# EAGLE design Project_02 (EAGLE 9.6.2)
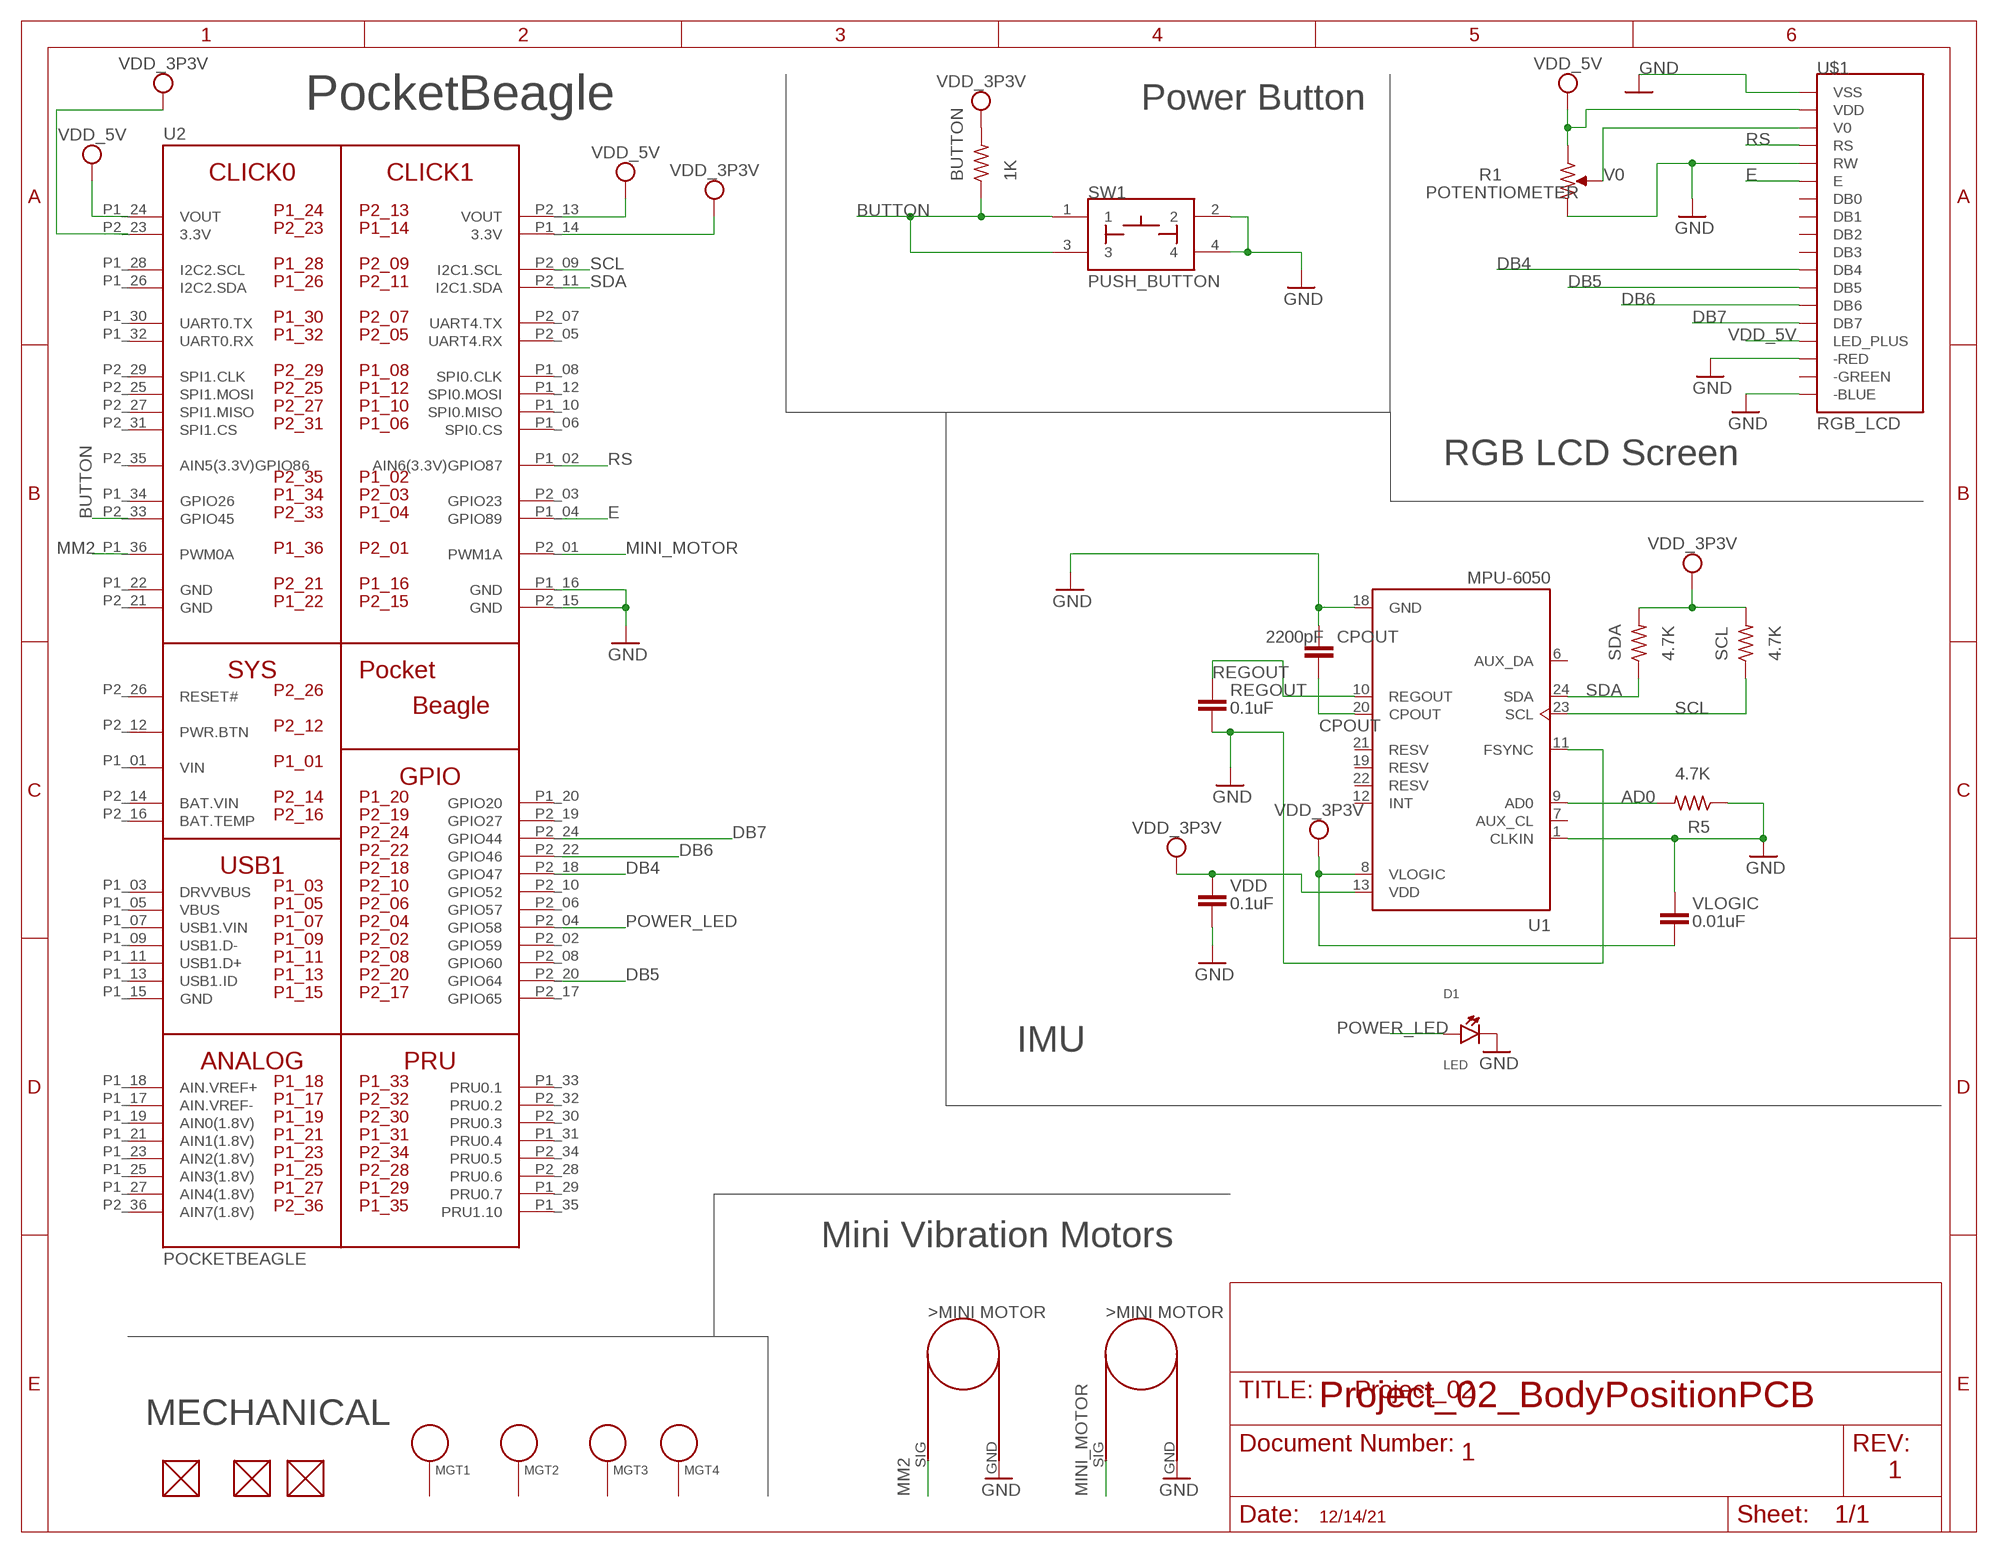
[diagram p0: schematic, sheet 1]

## Parts
BUTTON  1K  R_R0402  [R0402]
CPOUT  2200pF  C_C0603  [C0603]
D1  LED  [EIA-STD]
FUD1  FIDUCIAL  [FIDUCIAL_40MIL]
FUD2  FIDUCIAL  [FIDUCIAL_40MIL]
FUD3  FIDUCIAL  [FIDUCIAL_40MIL]
M1  MINI_MOTOR  [MINI_MOTOR]
M2  MINI_MOTOR  [MINI_MOTOR]
MGT1  MOUNTING_HOLE  [MOUNTING_HOLE]
MGT2  MOUNTING_HOLE  [MOUNTING_HOLE]
MGT3  MOUNTING_HOLE  [MOUNTING_HOLE]
MGT4  MOUNTING_HOLE  [MOUNTING_HOLE]
R1  POTENTIOMETER  [POT-PO90S]
R5  4.7K  R_R0402  [R0402]
REGOUT  0.1uF  C_C0603  [C0603]
SCL  4.7K  R_R0402  [R0402]
SDA  4.7K  R_R0402  [R0402]
SW1  PUSH_BUTTON  [BUTTON_12.5MM]
U1  MPU-6050  [MPU-6050]
U2  POCKETBEAGLE  [POCKETBEAGLE]
U$1  RGB_LCD  [RGB_LCD]
VDD  0.1uF  C_C0603  [C0603]
VLOGIC  0.01uF  C_C0603  [C0603]

## Nets
AD0: R5.2 U1.9(AD0)
BUTTON: BUTTON.1 SW1.1 SW1.3 U2.P2_33(GPIO45)
CPOUT: CPOUT.2 U1.20(CPOUT)
DB4: U2.P2_18(GPIO47) U$1.DB4
DB5: U2.P2_20(GPIO64) U$1.DB5
DB6: U2.P2_22(GPIO46) U$1.DB6
DB7: U2.P2_24(GPIO44) U$1.DB7
E: U2.P1_04(GPIO89) U$1.E
GND: CPOUT.1 D1.CATHODE M1.GND M2.GND R1.CW R5.1 REGOUT.2 SW1.2 SW1.4 U1.1(CLKIN) U1.11(FSYNC) U1.18(GND) U2.P1_16(GND) U2.P2_15(GND) U$1.-BLUE U$1.-RED U$1.RW U$1.VSS VDD.2 VLOGIC.1
MINI_MOTOR: M1.SIG(PWM) U2.P2_01(PWM1A)
MM2: M2.SIG(PWM) U2.P1_36(PWM0A)
POWER_LED: D1.ANODE U2.P2_04(GPIO58)
REGOUT: REGOUT.1 U1.10(REGOUT)
RS: U2.P1_02(AIN6(3.3V)GPIO87) U$1.RS
SCL: SCL.1 U1.23(SCL) U2.P2_09(I2C1.SCL)
SDA: SDA.1 U1.24(SDA) U2.P2_11(I2C1.SDA)
V0: R1.S U$1.V0
VDD_3P3V: BUTTON.2 SCL.2 SDA.2 U1.8(VLOGIC) U1.13(VDD) U2.P1_14(3.3V) U2.P2_23(3.3V) VDD.1 VLOGIC.2
VDD_5V: R1.CCW U2.P1_24(VOUT) U2.P2_13(VOUT) U$1.LED_PLUS U$1.VDD
Unconnected: FUD1.P$1 FUD2.P$1 FUD3.P$1 MGT1.P$1 MGT2.P$1 MGT3.P$1 MGT4.P$1 U1.6(AUX_DA) U1.7(AUX_CL) U1.12(INT) U1.19(RESV) U1.21(RESV) U1.22(RESV) U2.P1_03(DRVVBUS) U2.P1_05(VBUS) U2.P1_06(SPI0.CS) U2.P1_07(USB1.VIN) U2.P1_08(SPI0.CLK) U2.P1_09(USB1.D-) U2.P1_10(SPI0.MISO) U2.P1_11(USB1.D+) U2.P1_12(SPI0.MOSI) U2.P1_13(USB1.ID) U2.P1_15(GND) U2.P1_17(AIN.VREF-) U2.P1_18(AIN.VREF+) U2.P1_19(AIN0(1.8V)) U2.P1_20(GPIO20) U2.P1_21(AIN1(1.8V)) U2.P1_23(AIN2(1.8V)) U2.P1_25(AIN3(1.8V)) U2.P1_26(I2C2.SDA) U2.P1_27(AIN4(1.8V)) U2.P1_28(I2C2.SCL) U2.P1_29(PRU0.7) U2.P1_30(UART0.TX) U2.P1_31(PRU0.4) U2.P1_32(UART0.RX) U2.P1_33(PRU0.1) U2.P1_34(GPIO26) U2.P1_35(PRU1.10) U2.P2_02(GPIO59) U2.P2_03(GPIO23) U2.P2_05(UART4.RX) U2.P2_06(GPIO57) U2.P2_07(UART4.TX) U2.P2_08(GPIO60) U2.P2_10(GPIO52) U2.P2_12(PWR.BTN) U2.P2_16(BAT.TEMP) U2.P2_17(GPIO65) U2.P2_19(GPIO27) U2.P2_25(SPI1.MOSI) U2.P2_26(RESET#) U2.P2_27(SPI1.MISO) U2.P2_28(PRU0.6) U2.P2_29(SPI1.CLK) U2.P2_30(PRU0.3) U2.P2_31(SPI1.CS) U2.P2_32(PRU0.2) U2.P2_34(PRU0.5) U2.P2_35(AIN5(3.3V)GPIO86) U2.P2_36(AIN7(1.8V)) U$1.-GREEN U$1.DB0 U$1.DB1 U$1.DB2 U$1.DB3

## Notes on the sheet
- PocketBeagle | Power Button
- RGB LCD Screen
- IMU
- Mini Vibration Motors
- Project_02_BodyPositionPCB
- MECHANICAL
- 1
- 1
- 12/14/21

## Power pins joined to a net without a drawn wire
BAT.VIN: U2.P2_14(BAT.VIN)
GND: U2.P1_22(GND) U2.P2_21(GND)
VIN: U2.P1_01(VIN)

## Library data of the parts
BUTTON R5 SCL SDA = Project_02:R_: RESISTOR, American symbol
CPOUT REGOUT VDD VLOGIC = Project_02:C_: Capacitor SMD. Sizes: 0402, 0603 & 0805
D1 = Project_02:LED: EIA-STD LED, LTST-C191TBKT
FUD1-FUD3 = Project_02:FIDUCIAL
M1 M2 = Project_02:MINI_MOTOR
MGT1-MGT4 = Project_02:MOUNTING_HOLE: Chassis Mounting Hole w/GND connection ability
R1 = Project_02:POTENTIOMETER: Potentiometer - Examples: P090S-14T20BR10K (987-1277-ND)
SW1 = Project_02:PUSH_BUTTON
U1 = Project_02:MPU-6050: MPU-6050 Six-Axis (Gyro + Accelerometer) MEMS MotionTracking™ Devices Check prices <https://pricing.snapeda.com/parts/MPU-6050/TDK%20InvenSense/view-part?ref=eda>; AVAILABILITY: In Stock; DESCRIPTION: MPU-6050 series Accelerometer, Gyroscope, 3 Axis Sensor Evaluation Board; MF: TDK InvenSense; MP: MPU-6050; PACKAGE: QFN-24 InvenSense; PRICE: None; PURCHASE-URL: https://pricing.snapeda.com/search/part/MPU-6050/?ref=eda
U2 = Project_02:POCKETBEAGLE
U$1 = Project_02:RGB_LCD

## Board
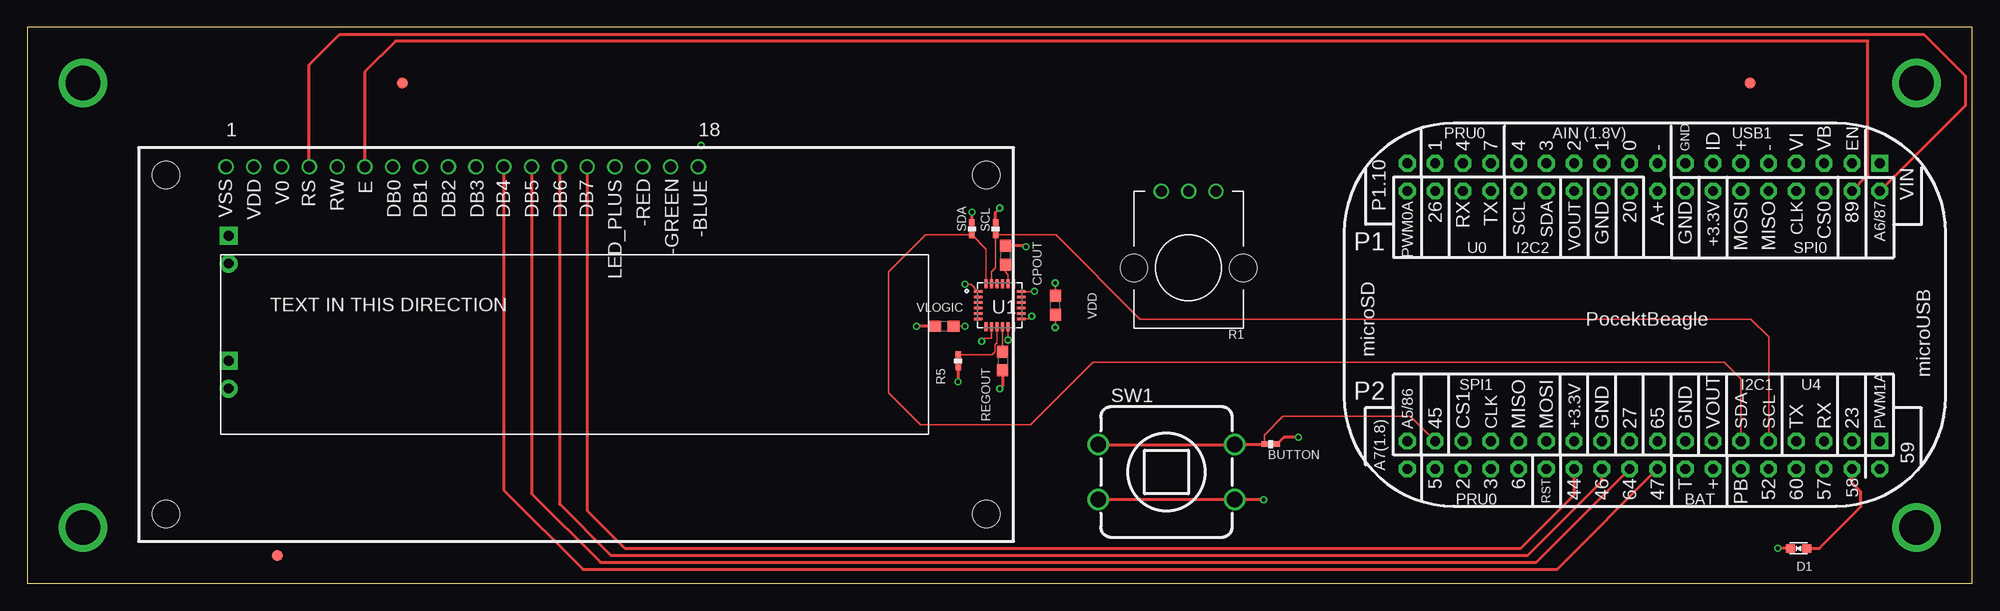
[diagram p1: board, top side]
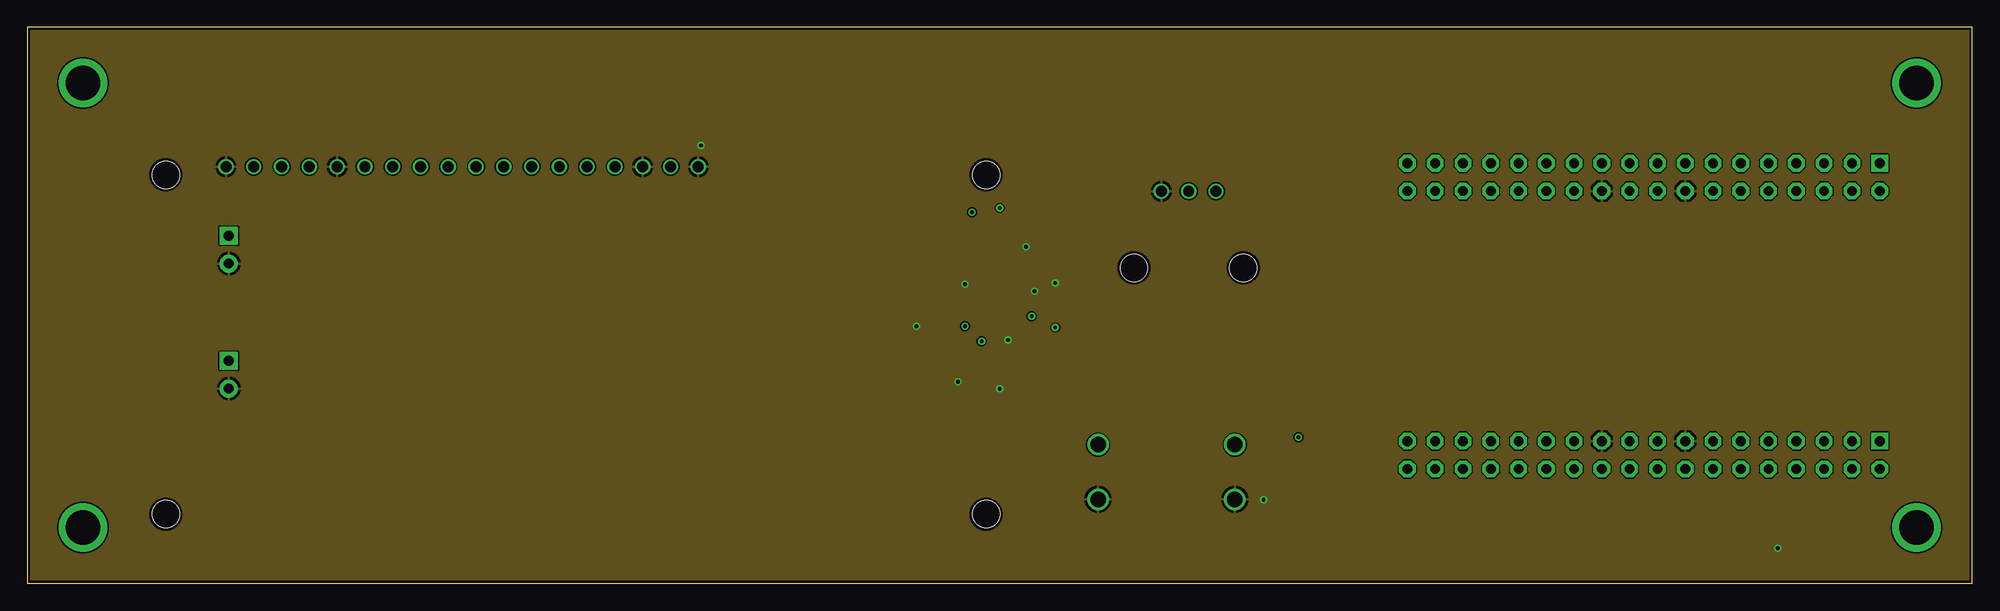
[diagram p2: board, inner layer Route2]
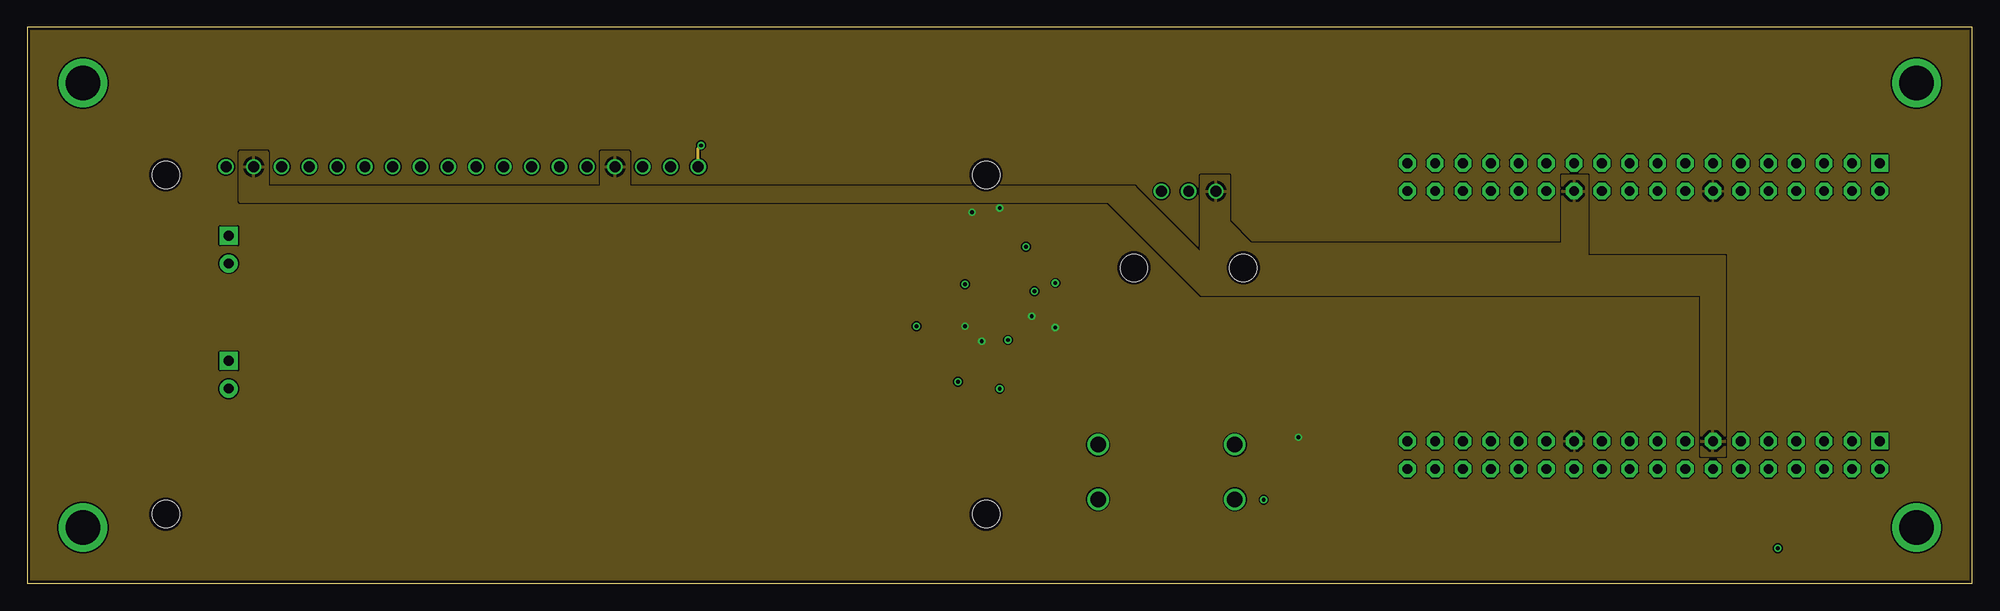
[diagram p3: board, inner layer Route15]
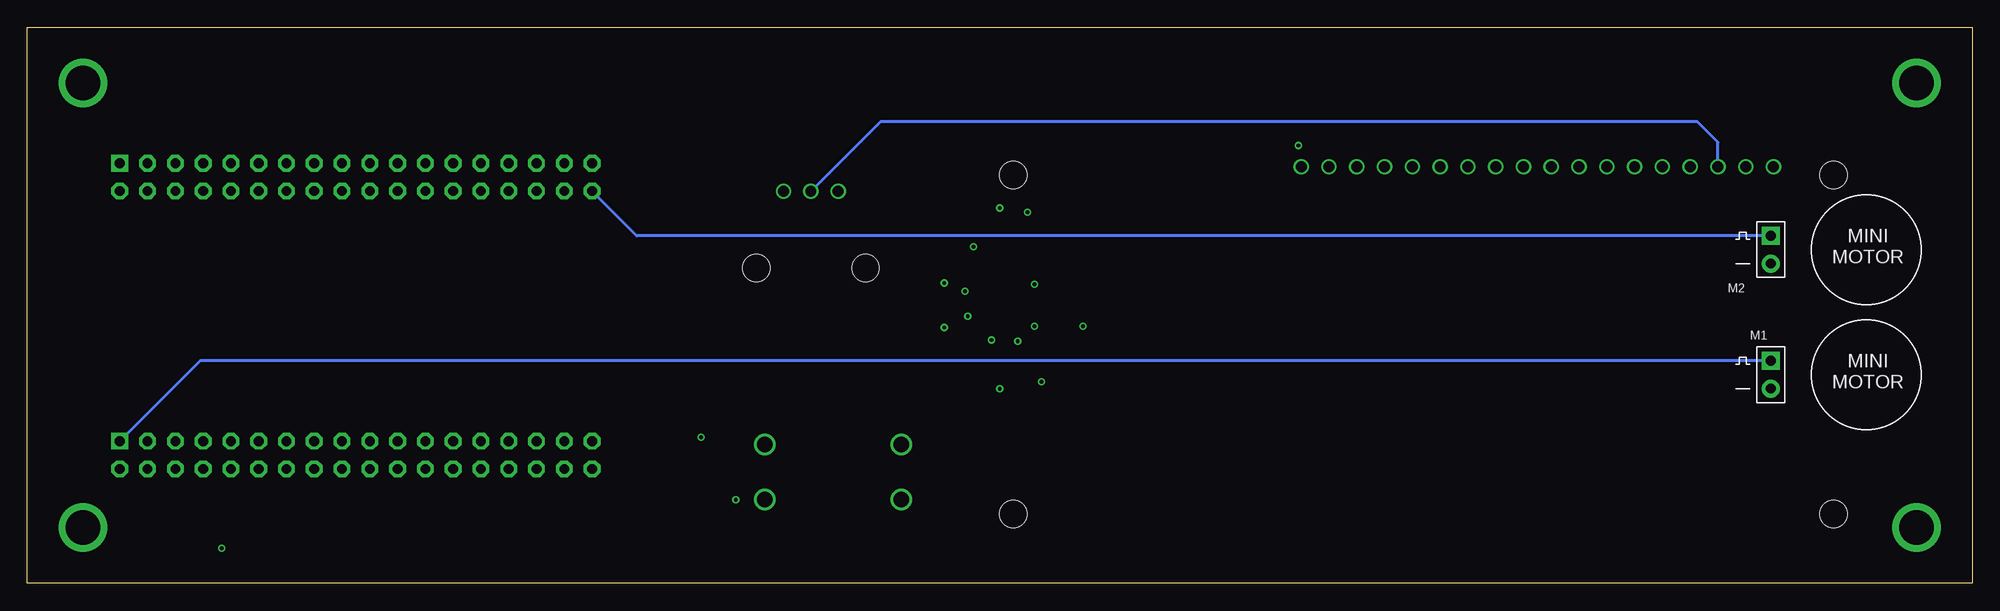
[diagram p4: board, bottom side, seen from below]

Size 177.8 x 50.8 mm. Coordinates in mm from the lower left corner, seen from the top.
Outline: 0,0 177.8,0 177.8,50.8 0,50.8 0,0
Copper layers (1*2*15*16): Top 0.035mm / dielectric 0.23mm / Route2 0.035mm / dielectric 0.93mm / Route15 0.035mm / dielectric 0.23mm / Bottom 0.035mm
Design rules "ENGI301_4lyr *": minimum track width 5mil, minimum drill 12mil, track to track 5mil, track to pad 5mil, pad to pad 5mil, via to via 5mil, smd to smd 5mil, copper to edge 10mil, drill to drill 12mil, minimum pad ring 6mil, minimum via ring 6mil, stop-mask expansion 3mil, vias tented up to drill 25mil, thermal gap 10mil

### Footprints (pad centres in the part's own frame; a part is rotated, then mirrored left to right if it is on the bottom)
R0402 = smd 0.61 x 0.508: 1 -0.559,0; 2 0.559,0
C0603 = smd 1.1 x 1: 1 -0.85,0; 2 0.85,0
EIA-STD = smd 0.8 x 0.8: ANODE -0.75,0; CATHODE 0.75,0
FIDUCIAL_40MIL = smd 1.016 x 1.016: P$1 0,0
MINI_MOTOR = drill 0.889 pad 1.651: GND 0,0 | drill 0.889 pad 1.651 square: SIG 0,2.54
MOUNTING_HOLE = drill 3.175 pad 4.445: P$1 0,0
POT-PO90S = drill 1: CCW -2.5,0; CW 2.5,0; S 0,0 | hole 2.5: -5,7; 5,7
BUTTON_12.5MM = drill 1.4: 1 -6.25,2.5; 2 -6.25,-2.5; 3 6.25,2.5; 4 6.25,-2.5
MPU-6050 = smd 0.79 x 0.26: 1 -1.97,1.25; 2 -1.97,0.75; 3 -1.97,0.25; 4 -1.97,-0.25; 5 -1.97,-0.75; 6 -1.97,-1.25; 13 1.97,-1.25; 14 1.97,-0.75; 15 1.97,-0.25; 16 1.97,0.25; 17 1.97,0.75; 18 1.97,1.25 | smd 0.26 x 0.79: 7 -1.25,-1.97; 8 -0.75,-1.97; 9 -0.25,-1.97; 10 0.25,-1.97; 11 0.75,-1.97; 12 1.25,-1.97; 19 1.25,1.97; 20 0.75,1.97; 21 0.25,1.97; 22 -0.25,1.97; 23 -0.75,1.97; 24 -1.25,1.97
POCKETBEAGLE = drill 0.889 pad 1.524 square: P1_01 5.91,3.53; P2_01 5.91,28.93 | drill 0.889 pad 1.524 octagon: P1_02 5.91,6.07; P1_03 8.45,3.53; P1_04 8.45,6.07; P1_05 10.99,3.53; P1_06 10.99,6.07; P1_07 13.53,3.53; P1_08 13.53,6.07; P1_09 16.07,3.53; P1_10 16.07,6.07; P1_11 18.61,3.53; P1_12 18.61,6.07; P1_13 21.15,3.53; P1_14 21.15,6.07; P1_15 23.69,3.53; P1_16 23.69,6.07; P1_17 26.23,3.53; P1_18 26.23,6.07; P1_19 28.77,3.53; P1_20 28.77,6.07; P1_21 31.31,3.53; P1_22 31.31,6.07; P1_23 33.85,3.53; P1_24 33.85,6.07; P1_25 36.39,3.53; P1_26 36.39,6.07; P1_27 38.93,3.53; P1_28 38.93,6.07; P1_29 41.47,3.53; P1_30 41.47,6.07; P1_31 44.01,3.53; P1_32 44.01,6.07; P1_33 46.55,3.53; P1_34 46.55,6.07; P1_35 49.09,3.53; P1_36 49.09,6.07; P2_02 5.91,31.47; P2_03 8.45,28.93; P2_04 8.45,31.47; P2_05 10.99,28.93; P2_06 10.99,31.47; P2_07 13.53,28.93; P2_08 13.53,31.47; P2_09 16.07,28.93; P2_10 16.07,31.47; P2_11 18.61,28.93; P2_12 18.61,31.47; P2_13 21.15,28.93; P2_14 21.15,31.47; P2_15 23.69,28.93; P2_16 23.69,31.47; P2_17 26.23,28.93; P2_18 26.23,31.47; P2_19 28.77,28.93; P2_20 28.77,31.47; P2_21 31.31,28.93; P2_22 31.31,31.47; P2_23 33.85,28.93; P2_24 33.85,31.47; P2_25 36.39,28.93; P2_26 36.39,31.47; P2_27 38.93,28.93; P2_28 38.93,31.47; P2_29 41.47,28.93; P2_30 41.47,31.47; P2_31 44.01,28.93; P2_32 44.01,31.47; P2_33 46.55,28.93; P2_34 46.55,31.47; P2_35 49.09,28.93; P2_36 49.09,31.47
RGB_LCD = drill 1: -BLUE 51.18,34.25; -GREEN 48.64,34.25; -RED 46.1,34.25; DB0 23.24,34.25; DB1 25.78,34.25; DB2 28.32,34.25; DB3 30.86,34.25; DB4 33.4,34.25; DB5 35.94,34.25; DB6 38.48,34.25; DB7 41.02,34.25; E 20.7,34.25; LED_PLUS 43.56,34.25; RS 15.62,34.25; RW 18.16,34.25; V0 13.08,34.25; VDD 10.54,34.25; VSS 8,34.25 | hole 2.5: 2.5,2.5; 77.5,2.5; 2.5,33.5; 77.5,33.5

### Placement (x,y rotation side)
BUTTON  113.67,12.7 0 top
CPOUT  89.41,29.97 270 top
D1  161.93,3.17 180 top
FUD1  34.29,45.72 0 top
FUD2  157.48,45.72 0 top
FUD3  22.86,2.54 0 top
M1  18.41,17.78 0 bottom
M2  18.41,29.21 0 bottom
MGT1  5.08,5.08 0 top
MGT2  172.72,45.72 0 top
MGT3  5.08,45.72 0 top
MGT4  172.72,5.08 0 top
R1  106.17,35.81 180 top
R5  85.09,20.32 90 top
REGOUT  89.15,20.32 270 top
SCL  88.52,32.38 90 top
SDA  86.36,32.38 90 top
SW1  104.14,10.16 0 top
U1  88.9,25.4 0 top
U2  175.26,41.91 180 top
U$1  10.16,3.81 0 top
VDD  93.98,25.4 90 top
VLOGIC  83.82,23.5 0 top

### Tracks (layer width: path | path; a pad name or v marks a point on that pad's centre or on a via)
AD0
  Top 0.127: R5.2 88.19,20.88 88.46,21.15 88.46,21.8 88.65,21.98 U1.9
BUTTON
  Top 0.127: BUTTON.1 113.11,13.54 114.81,15.24 126.45,15.24 U2.P2_33
  Top 0.254: SW1.1 SW1.3 110.43,12.7 BUTTON.1
CPOUT
  Top 0.127: CPOUT.2 89.41,28.45 89.66,28.19 89.66,27.38 U1.20
DB4
  Top 0.254: U$1.DB4 43.56,8.51 50.8,1.27 139.86,1.27 U2.P2_18
DB5
  Top 0.254: U$1.DB5 46.1,8.19 52.39,1.91 137.96,1.91 U2.P2_20
DB6
  Top 0.254: U$1.DB6 48.64,7.24 53.34,2.54 137.16,2.54 143.95,9.33 U2.P2_22
DB7
  Top 0.254: U$1.DB7 51.18,6.61 54.61,3.17 136.53,3.17 141.41,8.06 U2.P2_24
E
  Top 0.254: U2.P1_04 168.28,37.3 168.28,49.53 33.66,49.53 30.86,46.73 U$1.E
GND  (via drill 0.35)
  Top 0.127: VDD.2 v93.98,27.43 | U1.18 92.06,26.65 v92.08,26.67 | U1.11 89.65,22.24 v89.67,22.23 | U1.1 86.28,27.3 v85.72,27.3
  Top 0.254: SW1.2 SW1.4 112.99,7.66 v113.03,7.62 | D1.CATHODE v160.02,3.17 | REGOUT.2 89.15,18.03 v88.9,17.78 | R5.1 v85.09,18.41 | VLOGIC.1 v81.28,23.5 | v91.31,30.73 91.22,30.82 CPOUT.1
  Route2 0.254: 112.99,7.66 v113.03,7.62
  Route15 0.254: U$1.-BLUE 61.34,39.75 v61.59,40.01
  pour Route2 (rank 6): -2.54,-2.54 -2.54,53.34 180.34,53.34 180.34,-2.54
MINI_MOTOR
  Bottom 0.254: M1.SIG 162.01,20.32 U2.P2_01
MM2
  Bottom 0.254: M2.SIG 122.08,31.75 U2.P1_36
POWER_LED
  Top 0.254: D1.ANODE 163.83,3.17 167.64,6.99 167.64,8.34 166.81,9.17 U2.P2_04
REGOUT
  Top 0.127: U1.10 REGOUT.1
  Top 0.254: REGOUT.1
RS
  Top 0.254: U$1.RS 25.78,47.37 28.57,50.16 173.35,50.16 177.16,46.35 177.16,43.66 U2.P1_02
SCL
  Top 0.127: U1.23 88.14,27.38 88.14,28.45 88.52,28.83 SCL.1 94.03,31.83 101.73,24.13 157.56,24.13 159.19,22.5 U2.P2_09
SDA
  Top 0.127: U2.P2_11 156.65,18.7 155.15,20.19 97.41,20.19 91.69,14.48 81.66,14.48 78.74,17.4 78.74,28.45 82.12,31.83 SDA.1 87.65,30.54 87.65,27.39 | 87.65,27.39 87.64,27.38 | U1.24 87.65,27.39
V0
  Bottom 0.254: U$1.V0 23.24,40.3 25.13,42.19 99.8,42.19 R1.S
VDD_3P3V  (via drill 0.35)
  Top 0.127: 87.12,22.1 v87.25,22.1 87.52,22.36 88.15,22.36 U1.8 88.2,23.48 | 90.85,24.13 U1.13 91.59,24.15 v91.82,24.38 | VLOGIC.2 v85.72,23.5 | VDD.1 v93.98,23.37
  Top 0.254: BUTTON.2 114.86,13.34 v116.2,13.34 | SCL.2 88.52,33.91 v88.9,34.29 | SDA.2 v86.36,33.91
  pour Route15 (rank 6): -5.08,-5.08 -5.08,55.88 182.88,55.88 182.88,-5.08
VDD_5V
  pour Route15: 153.03,26.42 153.03,11.68 155.19,11.68 155.19,29.84 142.62,29.84 142.62,37.21 140.34,37.21 140.34,30.99 111.89,30.99 109.86,33.02 109.86,37.21 107.31,37.21 107.31,30.1 101.22,36.2 54.99,36.2 54.99,39.37 52.45,39.37 52.45,36.2 21.97,36.2 21.97,39.37 19.43,39.37 19.43,34.92 98.81,34.92 107.31,26.42

### Text on the board
Document: Body Position PCB | ENGI 301 | ALT